# Altium project DG_V3.PrjPcb
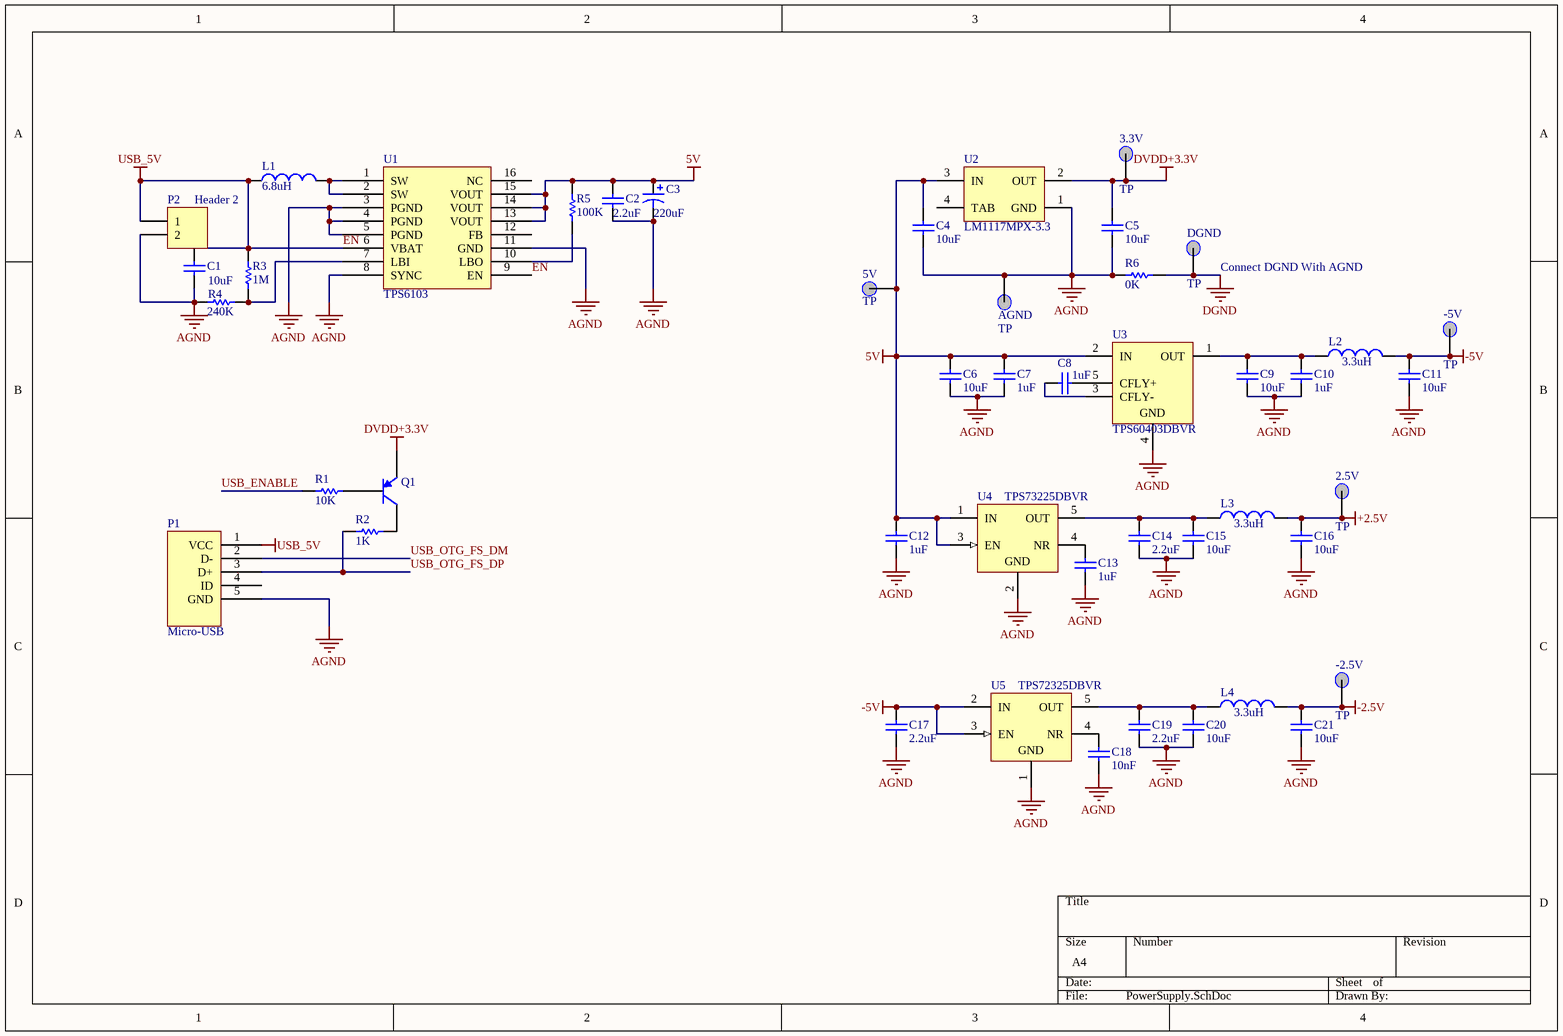
[diagram p0: PowerSupply.SchDoc]
3 sheets, 127 parts. Net scope: global (net labels, ports and power ports of the same name join across sheets).
Board file: DG_V3.PcbDoc
Sheets:
  PowerSupply.SchDoc
  MPU.SchDoc
  DG_V3.SchDoc

## Sheet PowerSupply.SchDoc
size A4

### Parts
2.5V  TP  [TestPort]
3.3V  TP  [TestPort]
5V  TP  [TestPort]
-2.5V  TP  [TestPort]
-5V  TP  [TestPort]
AGND  TP  [TestPort]
C1  10uF  [1608[0603]]
C2  2.2uF  [1608[0603]]
C3  220uF  [6TPF220M5L]
C4  10uF  [1608[0603]]
C5  10uF  [1608[0603]]
C6  10uF  [1608[0603]]
C7  1uF  [1608[0603]]
C8  1uF  [1608[0603]]
C9  10uF  [1608[0603]]
C10  1uF  [1608[0603]]
C11  10uF  [1608[0603]]
C12  1uF  [1608[0603]]
C13  1uF  [1608[0603]]
C14  2.2uF  [1608[0603]]
C15  10uF  [1608[0603]]
C16  10uF  [1608[0603]]
C17  2.2uF  [1608[0603]]
C18  10nF  [1608[0603]]
C19  2.2uF  [1608[0603]]
C20  10uF  [1608[0603]]
C21  10uF  [1608[0603]]
DGND  TP  [TestPort]
L1  6.8uH  [B82464G4682M]
L2  3.3uH  [2029]
L3  3.3uH  [2029]
L4  3.3uH  [2029]
P1  Micro-USB  [Micro-USB]
P2  Header 2  [HDR1X2]
Q1  PNP  [SOT-23B_N]  (value not drawn)
R1  10K  [J1-0603]
R2  1K  [J1-0603]
R3  1M  [J1-0603]
R4  240K  [J1-0603]
R5  100K  [J1-0603]
R6  0K  [J1-0603]
U1  TPS6103  [TI_PWP_G16]
U2  LM1117MPX-3.3  [MP04A_N]
U3  TPS60403DBVR  [TI-DBV5_N]
U4  TPS73225DBVR  [TI-DBV5_N]
U5  TPS72325DBVR  [TI-DBV5_N]

### Nets
5V: 5V.0 C2.2 C3.1 C4.1 C6.2 C7.2 C12.2 R5.2 U1.13(VOUT) U1.14(VOUT) U1.15(VOUT) U2.3(IN) U3.2(IN) U4.1(IN) U4.3(EN)
+2.5V: 2.5V.0 C16.2 L3.2
-2.5V: -2.5V.0 C21.2 L4.2
-5V: -5V.0 C11.2 C17.2 L2.2 U5.2(IN) U5.3(EN)
AGND: AGND.0 C1.1 C2.1 C3.2 C4.2 C5.2 C6.1 C7.1 C9.1 C10.1 C11.1 C12.1 C13.1 C14.1 C15.1 C16.1 C17.1 C18.1 C19.1 C20.1 C21.1 P1.5(GND) P2.2 R4.1 R6.1 U1.3(PGND) U1.4(PGND) U1.5(PGND) U1.8(SYNC) U1.11(GND) U2.1(GND) U3.4(GND) U4.2(GND) U5.1(GND)
DGND: DGND.0 R6.2
DVDD+3.3V: 3.3V.0 C5.1 Q1.3(E) U2.2(OUT)
EN: C1.2 L1.1 P1.1(VCC) P2.1 R3.2 U1.6(VBAT) U1.9(EN)  [also labelled USB_5V]
USB_ENABLE: R1.1
USB_OTG_FS_DM: P1.2(D-)
USB_OTG_FS_DP: P1.3(D+) R2.2
NetC8_1: C8.1 U3.3(CFLY-)
NetC8_2: C8.2 U3.5(CFLY+)
NetC9_2: C9.2 C10.2 L2.1 U3.1(OUT)
NetC13_2: C13.2 U4.4(NR)
NetC14_2: C14.2 C15.2 L3.1 U4.5(OUT)
NetC18_2: C18.2 U5.4(NR)
NetC19_2: C19.2 C20.2 L4.1 U5.5(OUT)
NetL1_2: L1.2 U1.1(SW) U1.2(SW)
NetQ1_1: Q1.1(C) R2.1
NetQ1_2: Q1.2(B) R1.2
NetR3_1: R3.1 R4.2 U1.7(LBI)
NetR5_1: R5.1 U1.10(LBO)

Not connected (* = marked no-connect by the designer): P1 4(ID); U1 12(FB) 16(NC); U2 4(TAB)

### Notes on the sheet
- (near DGND) Connect DGND With AGND

### Library data of the parts
2.5V 3.3V 5V -2.5V -5V AGND DGND = TestPoint
C1 C2 C4-C21 = Cap: Capacitor; Published: 8-Jun-2000; LatestRevisionDate: 17-Jul-2002; LatestRevisionNote: Re-released for DXP Platform.; PackageReference: RAD-0.3; Publisher: Altium Limited; PackageDescription: Radial Cap, Thru-Hole; 2 Leads; 0.3 in Pin Spacing
  C1 C4-C6 C9 C11 C15 C16 C20 C21: Value: 10uF
  C2 C14 C17 C19: Value: 2.2uF
  C7 C8 C10 C12 C13: Value: 1uF
  C18: Value: 10nF
C3 = Cap Pol1: Polarized Capacitor (Radial); Published: 8-Jun-2000; LatestRevisionDate: 17-Jul-2002; LatestRevisionNote: Re-released for DXP Platform.; PackageReference: RB7.6-15; Publisher: Altium Limited; PackageDescription: Polarized Capacitor (Radial); 2 Leads; Value: 220uF
L1-L4 = Inductor: Code_IEC: 1005; Published: 8-Jun-2000; LatestRevisionDate: 29-May-2009; LatestRevisionNote: IPC-7351 Footprint Added.; PackageReference: 0402-A; Publisher: Altium Limited; PackageDescription: Chip Inductor; Code_JEITA: 0402
  L1: Value: 6.8uH
  L2-L4: Value: 3.3uH
P2 = Header 2: Header, 2-Pin; LatestRevisionDate: 17-Jul-2002; LatestRevisionNote: Re-released for DXP Platform.; Publisher: Altium Limited
Q1 = PNP: PNP Bipolar Transistor; Published: 8-Jun-2000; LatestRevisionDate: 29-May-2009; LatestRevisionNote: IPC-7351 Footprint Added.; PackageVersion: Aug-1999; PackageReference: SOT-23B; Publisher: Altium Limited; PackageDescription: 3-Pin SOT-23 Package 0.95 mm Pitch, 2.4 mm Lead Span
R1-R6 = Res1: Resistor; Published: 8-Jun-2000; LatestRevisionDate: 17-Jul-2002; LatestRevisionNote: Re-released for DXP Platform.; PackageReference: AXIAL-0.3; Publisher: Altium Limited; PackageDescription: Axial Device, Thru-Hole; 2 Leads; 0.3 in Pin Spacing
  R1: Value: 10K
  R2: Value: 1K
  R3: Value: 1M
  R4: Value: 240K
  R5: Value: 100K
  R6: Value: 0K
U2 = LM1117MPX-3.3: 800mA Low-Dropout Linear Regulator, 4-pin SOT-223; Manufacturer: National Semiconductor; PackageTopMarking: XYTT*N05A; PowerWise: N; CompType: LDO IC; Published: 1-Mar-2010; DatasheetVersion: Apr-2006; PackageVersion: revB, Apr-2003; PackageReference: MP04A; Publisher: Altium Limited; PackageDescription: Molded SOT-223, 6.50 x 3.56 x 1.6mm Body, 4 Lead, 2.3mm Pitch; Supplier 1: Farnell; Supplier Part Number 1: 1652313; PartNumber: LM1117MPX-3.3; RoHS: N; PinCount: 4; Code_JEDEC: TO-261-AA; Code_IPC: SOT223-4; ComponentLink1Description: LM1117 Datasheet; ComponentLink1URL: http://www.national.com/ds/LM/LM1117.pdf; ComponentLink2Description: LM1117 Web Page; ComponentLink2URL: http://www.national.com/pf/LM/LM1117.html; ComponentLink3Description: MP04A Package Page; ComponentLink3URL: http://www.national.com/packaging/folders/mp04a.html
U3 = TPS60403DBVR: -1.8 to -5.25 V, Inverting Charge Pump Regulator, 60 mA, 1.8 to 5.25 V Input with 2-Cell Alkaline / Nixx Input, -40 to 85 degC, 5-pin SOT23 (DBV5), Green (RoHS & no Sb/Br); Manufacturer: Texas Instruments; 2-Cell Alkaline/Nixx Input: TRUE; Efficiency(Typ)(%): 99; Iout(Max)(A): 0.06; Iq(Typ)(mA): 0.425; Switching Frequency(Max)(kHz): 300; Topology: Inverting Buck/Boost; Vin(Max)(V): 5.25; Vin(Min)(V): 1.8; DatasheetVersion: SLVS324A; PackageVersion: 4073253-4/K; PackageReference: DBV5; PackageDescription: 5-Pin Plastic Small Outline, Body 1.60 脳 2.90 mm, Pitch 0.95 mm; Supplier 1: Digi-Key; Supplier Part Number 1: 296-27005-2-ND; Supplier 2: Digi-Key; Supplier Part Number 2: 296-27005-1-ND; Supplier 3: Digi-Key; Supplier Part Number 3: 296-27005-6-ND; Supplier 4: Newark; Supplier Part Number 4: 77C0631; Supplier 5: Mouser; Supplier Part Number 5: 595-TPS60403DBVR; Eco-Plan: Green (RoHS & no Sb/Br); Vout(Max)(V): -5.25; Vout(Min)(V): -1.8; Mounting Technology: Surface Mount; Code_JEDEC: MO-178; PartNumber: TPS60403DBVR; ComponentLink1Description: Manufacturer URL; ComponentLink1URL: http://www.ti.com/; ComponentLink2Description: Datasheet; ComponentLink2URL: http://www.ti.com/general/docs/lit/getliterature.tsp?genericPartNumber=TPS60403&fileType=pdf; ComponentLink3Description: Package Specification; ComponentLink3URL: http://www.ti.com/litv/pdf/mpds018i
U4 = TPS73225DBVR: Single Output Fast Transient Response LDO, 250 mA, Fixed 2.5 V Output, 1.7 to 5.5 V Input, with Reverse Current Protection, 5-pin SOT-23 (DBV), -40 to 85 degC, Green (RoHS & no Sb/Br); Manufacturer: Texas Instruments; Accuracy(%): 1; Fixed Output Options(V): 2.5; Iout(Max)(A): 0.25; Iq(Typ)(mA): 0.4; SubFamily: Single Channel LDO; Vdo(Typ)(mV): 40; Vin(Max)(V): 5.5; Vin(Min)(V): 1.7; DatasheetVersion: SBVS037O; PackageVersion: 4073253-4/K; PackageReference: DBV5; PackageDescription: 5-Pin Plastic Small Outline, Body 1.60 脳 2.90 mm, Pitch 0.95 mm; Supplier 1: Digi-Key; Supplier Part Number 1: TPS73225DBVR-ND; Supplier 2: Newark; Supplier Part Number 2: 87H2963; Supplier 3: Mouser; Supplier Part Number 3: 595-TPS73225DBVR; Eco-Plan: Green (RoHS & no Sb/Br); Vout Adj(Max)(V): 2.5; Vout Adj(Min)(V): 2.5; Mounting Technology: Surface Mount; Code_JEDEC: MO-178; PartNumber: TPS73225DBVR; ComponentLink1Description: Manufacturer URL; ComponentLink1URL: http://www.ti.com/; ComponentLink2Description: Datasheet; ComponentLink2URL: http://www.ti.com/general/docs/lit/getliterature.tsp?genericPartNumber=TPS73225&fileType=pdf; ComponentLink3Description: Package Specification; ComponentLink3URL: http://www.ti.com/litv/pdf/mpds018i
U5 = TPS72325DBVR: Single Output High PSRR LDO, 200 mA, Fixed -2.5 V Output, -10 to -2.7 V Input, 5-pin SOT-23 (DBV), -40 to 125 degC, Green (RoHS & no Sb/Br); Manufacturer: Texas Instruments; Accuracy(%): 2; Iout(Max)(A): 0.2; Iq(Typ)(mA): 0.13; SubFamily: Single Channel LDO; Vdo(Typ)(mV): 280; DatasheetVersion: SLVS346B; PackageVersion: 4073253-4/K; PackageReference: DBV5; PackageDescription: 5-Pin Plastic Small Outline, Body 1.60 脳 2.90 mm, Pitch 0.95 mm; Supplier 1: Digi-Key; Supplier Part Number 1: TPS72325DBVR-ND; Supplier 2: Newark; Supplier Part Number 2: 87H2932; Supplier 3: Mouser; Supplier Part Number 3: 595-TPS72325DBVR; Eco-Plan: Green (RoHS & no Sb/Br); Fixed Output Options(V): -2.5; Vin(Max)(V): -2.7; Vin(Min)(V): -10; Vout Adj(Max)(V): -2.5; Vout Adj(Min)(V): -2.5; Mounting Technology: Surface Mount; Code_JEDEC: MO-178; PartNumber: TPS72325DBVR; ComponentLink1Description: Manufacturer URL; ComponentLink1URL: http://www.ti.com/; ComponentLink2Description: Datasheet; ComponentLink2URL: http://www.ti.com/general/docs/lit/getliterature.tsp?genericPartNumber=TPS72325&fileType=pdf; ComponentLink3Description: Package Specification; ComponentLink3URL: http://www.ti.com/litv/pdf/mpds018i

## Sheet MPU.SchDoc
size A4
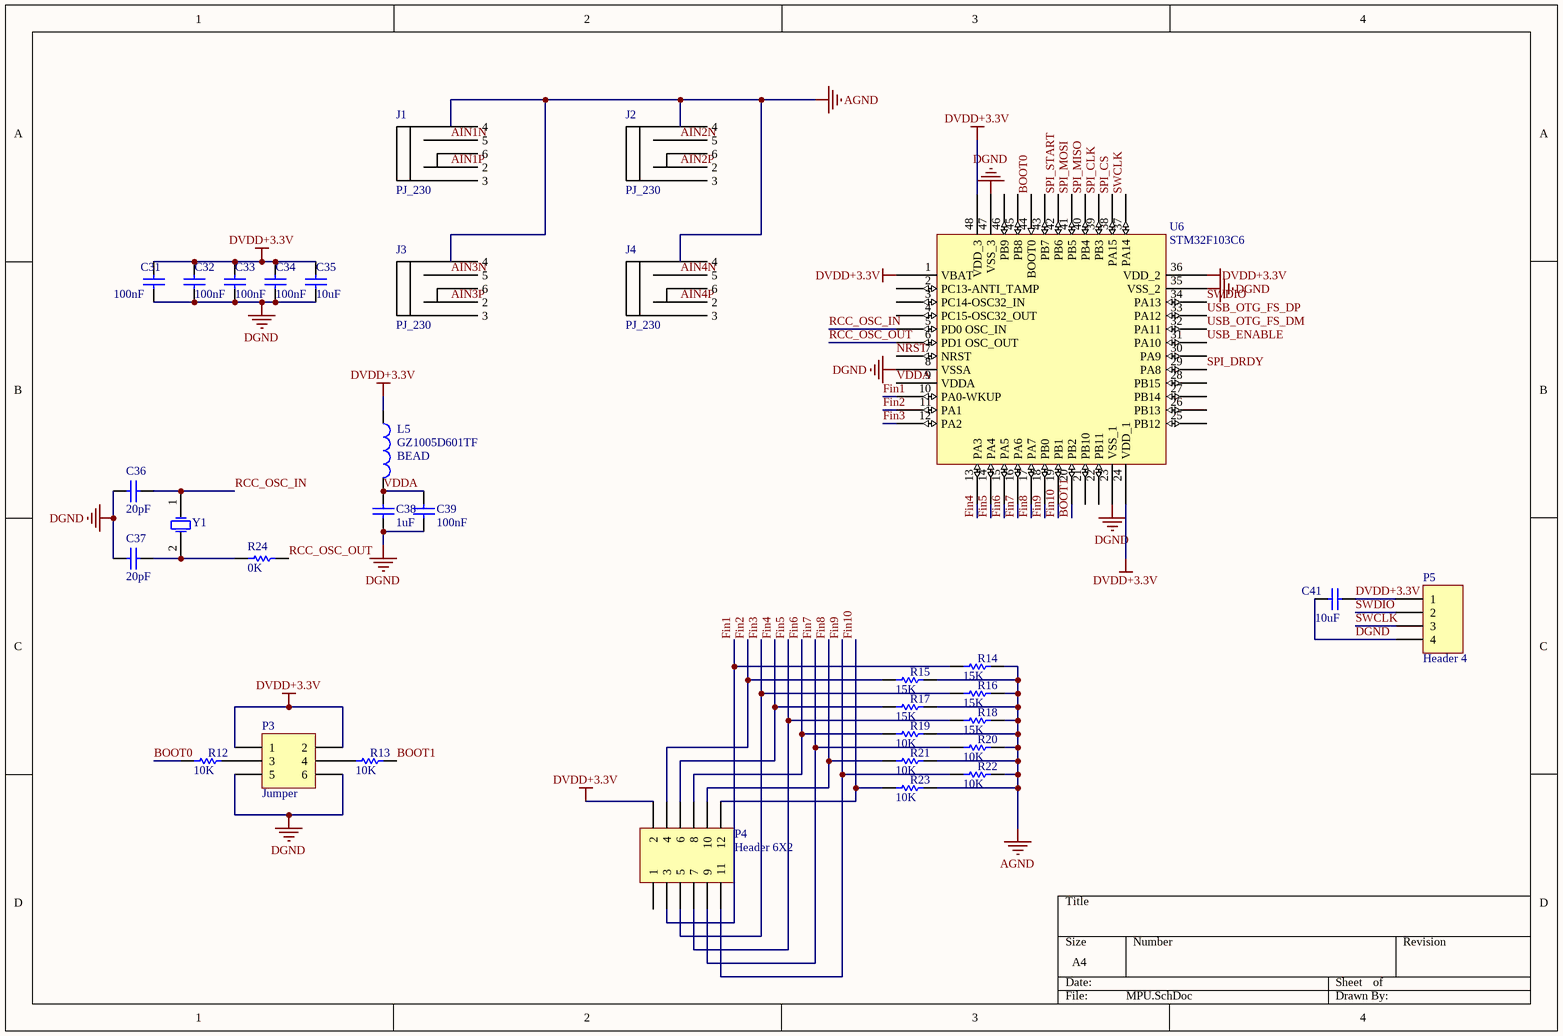
[diagram p1: MPU.SchDoc]

### Parts
C31  100nF  [1608[0603]]
C32  100nF  [1608[0603]]
C33  100nF  [1608[0603]]
C34  100nF  [1608[0603]]
C35  10uF  [1608[0603]]
C36  20pF  [1608[0603]]
C37  20pF  [1608[0603]]
C38  1uF  [1608[0603]]
C39  100nF  [1608[0603]]
C41  10uF  [1608[0603]]
J1  PJ_230  [PJ_230]
J2  PJ_230  [PJ_230]
J3  PJ_230  [PJ_230]
J4  PJ_230  [PJ_230]
L5  GZ1005D601TF  [0402-A]
P3  Jumper  [HDR2X3]
P4  Header 6X2  [HDR2X6]
P5  Header 4  [XH4]
R12  10K  [J1-0603]
R13  10K  [J1-0603]
R14  15K  [J1-0603]
R15  15K  [J1-0603]
R16  15K  [J1-0603]
R17  15K  [J1-0603]
R18  15K  [J1-0603]
R19  10K  [J1-0603]
R20  10K  [J1-0603]
R21  10K  [J1-0603]
R22  10K  [J1-0603]
R23  10K  [J1-0603]
R24  0K  [J1-0603]
U6  STM32F103C6  [STM32F103C8T6]
Y1  XTAL  [Crystal_HCM49]  (value not drawn)

### Nets
AGND: J1.4 J2.4 J3.4 J4.4 R14.2 R15.2 R16.2 R17.2 R18.2 R19.2 R20.2 R21.2 R22.2 R23.2
DGND: C31.1 C32.1 C33.1 C34.1 C35.1 C36.1 C37.1 C38.1 C39.1 C41.1 P3.5 P3.6 P5.4 U6.8(VSSA) U6.23(VSS_1) U6.35(VSS_2) U6.47(VSS_3)
DVDD+3.3V: C31.2 C32.2 C33.2 C34.2 C35.2 C41.2 L5.1 P3.1 P3.2 P4.2 P5.1 U6.1(VBAT) U6.24(VDD_1) U6.36(VDD_2) U6.48(VDD_3)
AIN1N: J1.5
AIN1P: J1.2
AIN2N: J2.5
AIN2P: J2.2
AIN3N: J3.5
AIN3P: J3.2
AIN4N: J4.5
AIN4P: J4.2
BOOT0: R12.1 U6.44(BOOT0)
BOOT1: R13.2 U6.20(PB2)
Fin1: P4.3 R14.1 U6.10(PA0-WKUP)
Fin2: P4.4 R15.1 U6.11(PA1)
Fin3: P4.5 R16.1 U6.12(PA2)
Fin4: P4.6 R17.1 U6.13(PA3)
Fin5: P4.7 R18.1 U6.14(PA4)
Fin6: P4.8 R19.1 U6.15(PA5)
Fin7: P4.9 R20.1 U6.16(PA6)
Fin8: P4.10 R21.1 U6.17(PA7)
Fin9: P4.11 R22.1 U6.18(PB0)
Fin10: P4.12 R23.1 U6.19(PB1)
NRST: U6.7(NRST)
RCC_OSC_IN: C36.2 U6.5(PD0_OSC_IN) Y1.1(OSC1)
RCC_OSC_OUT: R24.2 U6.6(PD1_OSC_OUT)
SPI_CLK: U6.39(PB3)
SPI_CS: U6.38(PA15)
SPI_DRDY: U6.29(PA8)
SPI_MISO: U6.40(PB4)
SPI_MOSI: U6.41(PB5)
SPI_START: U6.42(PB6)
SWCLK: P5.3 U6.37(PA14)
SWDIO: P5.2 U6.34(PA13)
USB_ENABLE: U6.31(PA10)
USB_OTG_FS_DM: U6.32(PA11)
USB_OTG_FS_DP: U6.33(PA12)
VDDA: C38.2 C39.2 L5.2 U6.9(VDDA)
NetC37_2: C37.2 R24.1 Y1.2(OSC2)
NetP3_3: P3.3 R12.2
NetP3_4: P3.4 R13.1

Not connected (* = marked no-connect by the designer): J1 3 6; J2 3 6; J3 3 6; J4 3 6; P4 1; U6 2(PC13-ANTI_TAMP) 3(PC14-OSC32_IN) 4(PC15-OSC32_OUT) 21(PB10) 22(PB11) 25(PB12) 26(PB13) 27(PB14) 28(PB15) 30(PA9) 43(PB7) 45(PB8) 46(PB9)

### Notes on the sheet
- (near L5) BEAD

### Library data of the parts
C31-C39 C41 = Cap: Capacitor; Published: 8-Jun-2000; LatestRevisionDate: 17-Jul-2002; LatestRevisionNote: Re-released for DXP Platform.; PackageReference: RAD-0.3; Publisher: Altium Limited; PackageDescription: Radial Cap, Thru-Hole; 2 Leads; 0.3 in Pin Spacing
  C31-C34 C39: Value: 100nF
  C35 C41: Value: 10uF
  C36 C37: Value: 20pF
  C38: Value: 1uF
J1-J4 = PJ_230: Phone Jack
L5 = Inductor: Code_IEC: 1005; Published: 8-Jun-2000; LatestRevisionDate: 29-May-2009; LatestRevisionNote: IPC-7351 Footprint Added.; PackageReference: 0402-A; Publisher: Altium Limited; PackageDescription: Chip Inductor; Code_JEITA: 0402
P3 = Header 3X2: Header, 3-Pin, Dual row; LatestRevisionDate: 17-Jul-2002; LatestRevisionNote: Re-released for DXP Platform.; Publisher: Altium Limited
P4 = Header 6X2: Header, 6-Pin, Dual row; LatestRevisionDate: 17-Jul-2002; LatestRevisionNote: Re-released for DXP Platform.; Publisher: Altium Limited
P5 = Header 4: Header, 4-Pin; LatestRevisionDate: 17-Jul-2002; LatestRevisionNote: Re-released for DXP Platform.; Publisher: Altium Limited
R12-R24 = Res1: Resistor; Published: 8-Jun-2000; LatestRevisionDate: 17-Jul-2002; LatestRevisionNote: Re-released for DXP Platform.; PackageReference: AXIAL-0.3; Publisher: Altium Limited; PackageDescription: Axial Device, Thru-Hole; 2 Leads; 0.3 in Pin Spacing
  R12 R13 R19-R23: Value: 10K
  R14-R18: Value: 15K
  R24: Value: 0K
U6 = STM32F103C8T6: IC MCU 32BIT 64KB FLASH 48LQFP
Y1 = XTAL: Crystal Oscillator; Published: 8-Jun-2000; LatestRevisionDate: 17-Jul-2002; LatestRevisionNote: Re-released for DXP Platform.; PackageReference: R38; Publisher: Altium Limited; PackageDescription: Crystal, Thru-Hole; 2 Leads; Body 3.1 x 8.2 mm (Dia.xH)

## Sheet DG_V3.SchDoc
size A4
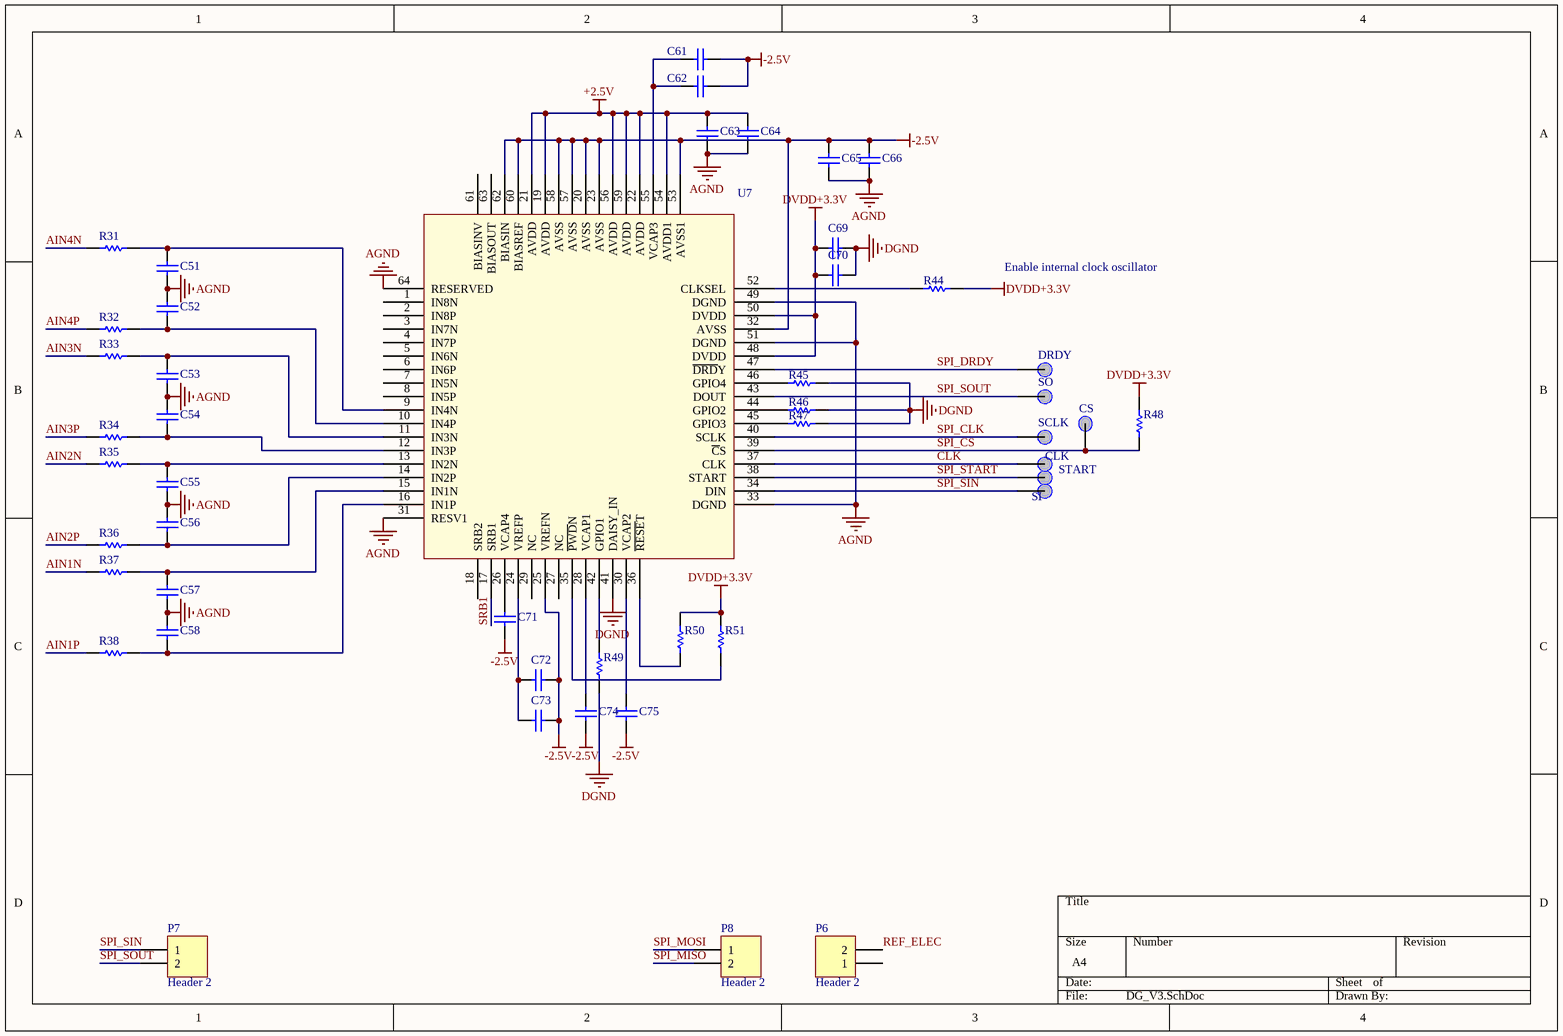
[diagram p2: DG_V3.SchDoc]

### Parts
C51  4.7nF  [1608[0603]]  (value not drawn)
C52  4.7nF  [1608[0603]]  (value not drawn)
C53  4.7nF  [1608[0603]]  (value not drawn)
C54  4.7nF  [1608[0603]]  (value not drawn)
C55  4.7nF  [1608[0603]]  (value not drawn)
C56  4.7nF  [1608[0603]]  (value not drawn)
C57  4.7nF  [1608[0603]]  (value not drawn)
C58  4.7nF  [1608[0603]]  (value not drawn)
C61  100nF  [1608[0603]]  (value not drawn)
C62  1uF  [1608[0603]]  (value not drawn)
C63  1uF  [1608[0603]]  (value not drawn)
C64  0.1uF  [1608[0603]]  (value not drawn)
C65  1uF  [1608[0603]]  (value not drawn)
C66  0.1uF  [1608[0603]]  (value not drawn)
C69  1uF  [1608[0603]]  (value not drawn)
C70  0.1uF  [1608[0603]]  (value not drawn)
C71  1uF  [1608[0603]]  (value not drawn)
C72  10uF  [1608[0603]]  (value not drawn)
C73  100nF  [1608[0603]]  (value not drawn)
C74  100uF  [1608[0603]]  (value not drawn)
C75  1uF  [1608[0603]]  (value not drawn)
CLK  TP  [TestPort]  (value not drawn)
CS  TP  [TestPort]  (value not drawn)
DRDY  TP  [TestPort]  (value not drawn)
P6  Header 2  [HDR1X2]
P7  Header 2  [HDR1X2]
P8  Header 2  [HDR1X2]
R31  4.99K  [J1-0603]  (value not drawn)
R32  4.99K  [J1-0603]  (value not drawn)
R33  4.99K  [J1-0603]  (value not drawn)
R34  4.99K  [J1-0603]  (value not drawn)
R35  4.99K  [J1-0603]  (value not drawn)
R36  4.99K  [J1-0603]  (value not drawn)
R37  4.99K  [J1-0603]  (value not drawn)
R38  4.99K  [J1-0603]  (value not drawn)
R44  10K  [J1-0603]  (value not drawn)
R45  10K  [J1-0603]  (value not drawn)
R46  10K  [J1-0603]  (value not drawn)
R47  10K  [J1-0603]  (value not drawn)
R48  10K  [J1-0603]  (value not drawn)
R49  10K  [J1-0603]  (value not drawn)
R50  10K  [J1-0603]  (value not drawn)
R51  10K  [J1-0603]  (value not drawn)
SCLK  TP  [TestPort]  (value not drawn)
SI  TP  [TestPort]  (value not drawn)
SO  TP  [TestPort]  (value not drawn)
START  TP  [TestPort]  (value not drawn)
U7  ADS1299  [PQFP-64N]  (value not drawn)

### Nets
+2.5V: C63.2 C64.2 U7.19(AVDD) U7.21(AVDD) U7.22(AVDD) U7.54(AVDD1) U7.56(AVDD) U7.59(AVDD)
-2.5V: C61.1 C62.1 C65.2 C66.2 C71.1 C72.2 C73.2 C74.1 C75.1 U7.20(AVSS) U7.23(AVSS) U7.25(VREFN) U7.32(AVSS) U7.53(AVSS1) U7.57(AVSS) U7.58(AVSS) U7.60(BIASREF) U7.62(BIASIN)
AGND: C51.1 C52.2 C53.1 C54.2 C55.1 C56.2 C57.1 C58.2 C63.1 C64.1 C65.1 C66.1 U7.31(RESV1) U7.33(DGND) U7.49(DGND) U7.51(DGND) U7.64(RESERVED)
DGND: C69.1 C70.1 R45.1 R46.1 R47.1 R49.1 U7.41(DAISY_IN)
DVDD+3.3V: C69.2 C70.2 R44.1 R48.1 R50.1 R51.1 U7.48(DVDD) U7.50(DVDD)
AIN1N: R37.1
AIN1P: R38.1
AIN2N: R35.1
AIN2P: R36.1
AIN3N: R33.1
AIN3P: R34.1
AIN4N: R31.1
AIN4P: R32.1
CLK: CLK.0 U7.37(CLK)
REF_ELEC: P6.2
SPI_CLK: SCLK.0 U7.40(SCLK)
SPI_CS: CS.0 R48.2 U7.39(~{C}S)
SPI_DRDY: DRDY.0 U7.47(~{DRD}Y)
SPI_MISO: P8.2
SPI_MOSI: P8.1
SPI_SIN: P7.1 SI.0 U7.34(DIN)
SPI_SOUT: P7.2 SO.0 U7.43(DOUT)
SPI_START: START.0 U7.38(START)
SRB1: U7.17(SRB1)
NetC51_2: C51.2 R31.2 U7.9(IN4N)
NetC52_1: C52.1 R32.2 U7.10(IN4P)
NetC53_2: C53.2 R33.2 U7.11(IN3N)
NetC54_1: C54.1 R34.2 U7.12(IN3P)
NetC55_2: C55.2 R35.2 U7.13(IN2N)
NetC56_1: C56.1 R36.2 U7.14(IN2P)
NetC57_2: C57.2 R37.2 U7.15(IN1N)
NetC58_1: C58.1 R38.2 U7.16(IN1P)
NetC61_2: C61.2 C62.2 U7.55(VCAP3)
NetC71_2: C71.2 U7.26(VCAP4)
NetC72_1: C72.1 C73.1 U7.24(VREFP)
NetC74_2: C74.2 U7.28(VCAP1)
NetC75_2: C75.2 U7.30(VCAP2)
NetR44_2: R44.2 U7.52(CLKSEL)
NetR45_2: R45.2 U7.46(GPIO4)
NetR46_2: R46.2 U7.44(GPIO2)
NetR47_2: R47.2 U7.45(GPIO3)
NetR49_2: R49.2 U7.42(GPIO1)
NetR50_2: R50.2 U7.36(~{RESE}T)
NetR51_2: R51.2 U7.35(~{PWD}N)

Not connected (* = marked no-connect by the designer): P6 1; U7 1(IN8N) 2(IN8P) 3(IN7N) 4(IN7P) 5(IN6N) 6(IN6P) 7(IN5N) 8(IN5P) 18(SRB2) 27(NC) 29(NC) 61(BIASINV) 63(BIASOUT)

### Notes on the sheet
- Enable internal clock oscillator

### Library data of the parts
C51-C58 C61-C66 C69-C75 = Cap: Capacitor; Published: 8-Jun-2000; LatestRevisionDate: 17-Jul-2002; LatestRevisionNote: Re-released for DXP Platform.; PackageReference: RAD-0.3; Publisher: Altium Limited; PackageDescription: Radial Cap, Thru-Hole; 2 Leads; 0.3 in Pin Spacing
  C51-C58: Value: 4.7nF
  C61 C73: Value: 100nF
  C62 C63 C65 C69 C71 C75: Value: 1uF
  C64 C66 C70: Value: 0.1uF
  C72: Value: 10uF
  C74: Value: 100uF
CLK CS DRDY SCLK SI SO START = TestPoint
P6-P8 = Header 2: Header, 2-Pin; LatestRevisionDate: 17-Jul-2002; LatestRevisionNote: Re-released for DXP Platform.; Publisher: Altium Limited
R31-R38 R44-R51 = Res1: Resistor; Published: 8-Jun-2000; LatestRevisionDate: 17-Jul-2002; LatestRevisionNote: Re-released for DXP Platform.; PackageReference: AXIAL-0.3; Publisher: Altium Limited
  R31-R38: PackageDescription: Axial Device, Thru-Hole; 2 Leads; 0.3 in Pin Spacing; Value: 4.99K
  R44-R47 R49-R51: PackageDescription: Axial Device, Thru-Hole; 2 Leads; 0.3 in Pin Spacing; Value: 10K
  R48: Value: 10K

## Nets that join several sheets
+2.5V: PowerSupply (2.5V.0 C16.2 L3.2), DG_V3 (8 pins)
-2.5V: PowerSupply (-2.5V.0 C21.2 L4.2), DG_V3 (18 pins)
AGND: PowerSupply (34 pins), MPU (14 pins), DG_V3 (17 pins)
DGND: PowerSupply (DGND.0 R6.2), MPU (17 pins), DG_V3 (7 pins)
DVDD+3.3V: PowerSupply (3.3V.0 C5.1 Q1.3 U2.2), MPU (15 pins), DG_V3 (8 pins)
AIN1N: MPU (J1.5), DG_V3 (R37.1)
AIN1P: MPU (J1.2), DG_V3 (R38.1)
AIN2N: MPU (J2.5), DG_V3 (R35.1)
AIN2P: MPU (J2.2), DG_V3 (R36.1)
AIN3N: MPU (J3.5), DG_V3 (R33.1)
AIN3P: MPU (J3.2), DG_V3 (R34.1)
AIN4N: MPU (J4.5), DG_V3 (R31.1)
AIN4P: MPU (J4.2), DG_V3 (R32.1)
SPI_CLK: MPU (U6.39), DG_V3 (SCLK.0 U7.40)
SPI_CS: MPU (U6.38), DG_V3 (CS.0 R48.2 U7.39)
SPI_DRDY: MPU (U6.29), DG_V3 (DRDY.0 U7.47)
SPI_MISO: MPU (U6.40), DG_V3 (P8.2)
SPI_MOSI: MPU (U6.41), DG_V3 (P8.1)
SPI_START: MPU (U6.42), DG_V3 (START.0 U7.38)
USB_ENABLE: PowerSupply (R1.1), MPU (U6.31)
USB_OTG_FS_DM: PowerSupply (P1.2), MPU (U6.32)
USB_OTG_FS_DP: PowerSupply (P1.3 R2.2), MPU (U6.33)